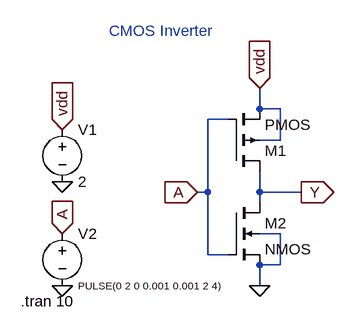
[diagram p0: schematic CMOS INVERTER.asc]
CMOS INVERTER.asc, the LTspice schematic file:
Version 4
SHEET 1 880 680
WIRE 336 48 336 16
WIRE 368 48 336 48
WIRE 288 64 256 64
WIRE 368 96 368 48
WIRE 368 96 336 96
WIRE 256 176 256 64
WIRE 256 176 240 176
WIRE 336 176 336 144
WIRE 400 176 336 176
WIRE 336 192 336 176
WIRE 368 240 336 240
WIRE 256 272 256 176
WIRE 288 272 256 272
WIRE 368 288 368 240
WIRE 368 288 336 288
WIRE 336 320 336 288
FLAG 336 320 0
FLAG 32 160 0
FLAG 32 320 0
FLAG 336 16 vdd
IOPIN 336 16 In
FLAG 32 80 vdd
IOPIN 32 80 In
FLAG 32 240 A
IOPIN 32 240 In
FLAG 400 176 Y
IOPIN 400 176 Out
FLAG 240 176 A
IOPIN 240 176 In
SYMBOL pmos4 288 144 M180
SYMATTR InstName M1
SYMBOL nmos4 288 192 R0
SYMATTR InstName M2
SYMBOL voltage 32 64 R0
WINDOW 123 0 0 Left 0
WINDOW 39 0 0 Left 0
SYMATTR InstName V1
SYMATTR Value 2
SYMBOL voltage 32 224 R0
WINDOW 3 24 96 Left 1
WINDOW 123 0 0 Left 0
WINDOW 39 0 0 Left 0
SYMATTR Value PULSE(0 2 0 0.001 0.001 2 4)
SYMATTR InstName V2
TEXT -32 344 Left 2 !.tran 10
TEXT 104 -72 Left 2 ;CMOS Inverter

The netlist it stands for:
* CMOS INVERTER.asc
M1 Y A vdd vdd PMOS
M2 Y A 0 0 NMOS
V1 vdd 0 2
V2 A 0 PULSE(0 2 0 0.001 0.001 2 4)
.model NMOS NMOS
.model PMOS PMOS
.lib standard.mos
.tran 10
* CMOS Inverter
.backanno
.end